# Altium schematic sheet PCB_DecoderB.SchDoc
size A4; DocumentNumber: 4; SheetNumber: 4; SheetTotal: 8
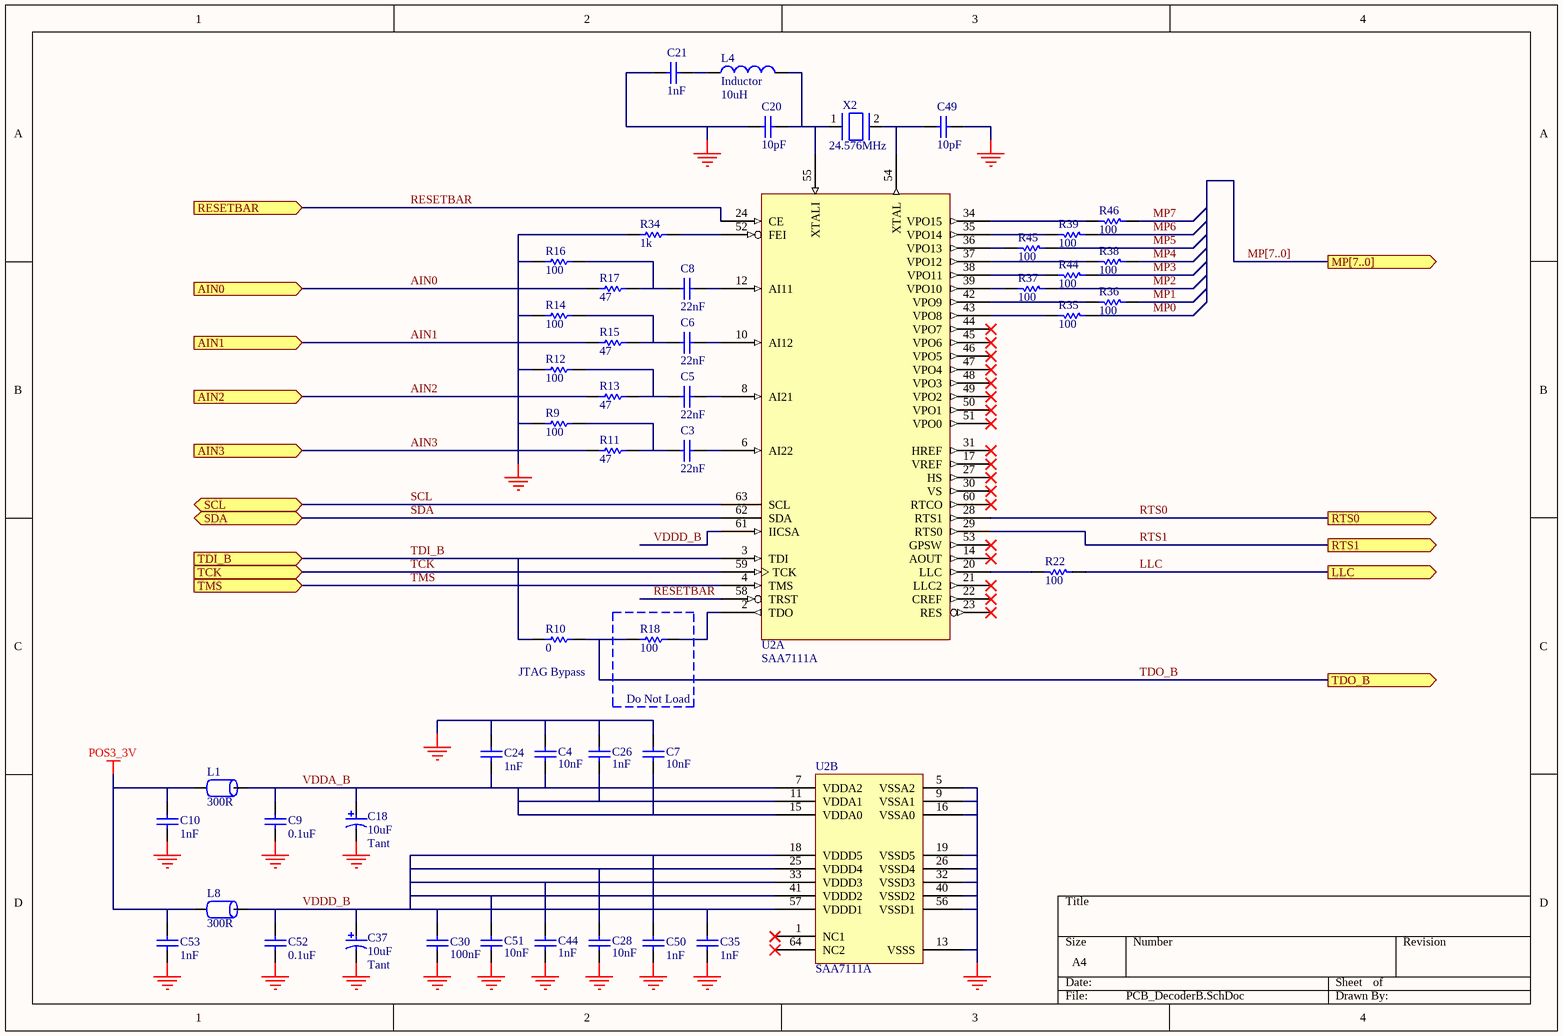
[diagram p0: PCB_DecoderB.SchDoc]

## Parts
C3  22nF  [CC2012-0805]
C4  10nF  [CC2012-0805]
C5  22nF  [CC2012-0805]
C6  22nF  [CC2012-0805]
C7  10nF  [CC2012-0805]
C8  22nF  [CC2012-0805]
C9  0.1uF  [CC2012-0805]
C10  1nF  [CC2012-0805]
C18  10uF  Capacitor Type: Tant  [MCCT-B]
C20  10pF  [CC2012-0805]
C21  1nF  [CC2012-0805]
C24  1nF  [CC2012-0805]
C26  1nF  [CC2012-0805]
C28  10nF  [CC2012-0805]
C30  100nF  [CC2012-0805]
C35  1nF  [CC2012-0805]
C37  10uF  Capacitor Type: Tant  [MCCT-B]
C44  1nF  [CC2012-0805]
C49  10pF  [CC2012-0805]
C50  1nF  [CC2012-0805]
C51  10nF  [CC2012-0805]
C52  0.1uF  [CC2012-0805]
C53  1nF  [CC2012-0805]
L1  300R  [CC2012-0805]
L4  Inductor  value 10uH  [SIMID1008-A]
L8  300R  [CC2012-0805]
R9  100  [CC2012-0805]
R10  0  [CC2012-0805]
R11  47  [CC2012-0805]
R12  100  [CC2012-0805]
R13  47  [CC2012-0805]
R14  100  [CC2012-0805]
R15  47  [CC2012-0805]
R16  100  [CC2012-0805]
R17  47  [CC2012-0805]
R18  100  [CC2012-0805]
R22  100  [CC2012-0805]
R34  1k  [CC2012-0805]
R35  100  [CC2012-0805]
R36  100  [CC2012-0805]
R37  100  [CC2012-0805]
R38  100  [CC2012-0805]
R39  100  [CC2012-0805]
R44  100  [CC2012-0805]
R45  100  [CC2012-0805]
R46  100  [CC2012-0805]
U2  SAA7111A  [QFP14X14_64]  (parts A,B of 2)
X2  24.576MHz  [QC49/SMD]

## Blocks framed on the sheet
Do Not Load: R18

## Ports
AIN0 (in), AIN1 (in), AIN2 (in), AIN3 (in), LLC (out), MP[7..0] (out), RESETBAR (in), RTS0 (out), RTS1 (out), SCL (bidir), SDA (bidir), TCK (in), TDI_B (in), TDO_B (out), TMS (in)

## Nets
GND: C4.1 C7.1 C9.2 C10.2 C18.2 C20.1 C21.1 C24.1 C26.1 C28.2 C30.2 C35.2 C37.2 C44.2 C49.2 C50.2 C51.2 C52.2 C53.2 R9.1 R12.1 R14.1 R16.1 R34.1 U2.5(VSSA2) U2.9(VSSA1) U2.13(VSSS) U2.16(VSSA0) U2.19(VSSD5) U2.26(VSSD4) U2.32(VSSD3) U2.40(VSSD2) U2.56(VSSD1)
POS3_3V: C10.1 C53.1 L1.1 L8.1
AIN0: R17.1 ; port AIN0
AIN1: R15.1 ; port AIN1
AIN2: R13.1 ; port AIN2
AIN3: R11.1 ; port AIN3
LLC: R22.1 ; port LLC
MP0: R35.1
MP1: R36.1
MP2: R37.1
MP3: R44.1
MP4: R38.1
MP5: R45.1
MP6: R39.1
MP7: R46.1
RESETBAR: U2.24(CE) U2.58(TRST) ; port RESETBAR
RTS0: U2.28(RTS1) ; port RTS0
RTS1: U2.29(RTS0) ; port RTS1
SCL: U2.63(SCL) ; port SCL
SDA: U2.62(SDA) ; port SDA
TCK: U2.59(TCK) ; port TCK
TDI_B: R10.1 U2.3(TDI) ; port TDI_B
TDO_B: R10.2 R18.1 ; port TDO_B
TMS: U2.4(TMS) ; port TMS
VDDA_B: C4.2 C7.2 C9.1 C18.1 C24.2 C26.2 L1.2 U2.7(VDDA2) U2.11(VDDA1) U2.15(VDDA0)
VDDD_B: C28.1 C30.1 C35.1 C37.1 C44.1 C50.1 C51.1 C52.1 L8.2 U2.18(VDDD5) U2.25(VDDD4) U2.33(VDDD3) U2.41(VDDD2) U2.57(VDDD1) U2.61(IICSA)
NetC3_1: C3.1 R9.2 R11.2
NetC3_2: C3.2 U2.6(AI22)
NetC5_1: C5.1 R12.2 R13.2
NetC5_2: C5.2 U2.8(AI21)
NetC6_1: C6.1 R14.2 R15.2
NetC6_2: C6.2 U2.10(AI12)
NetC8_1: C8.1 R16.2 R17.2
NetC8_2: C8.2 U2.12(AI11)
NetC20_2: C20.2 L4.2 U2.55(XTALI) X2.1
NetC21_2: C21.2 L4.1
NetC49_1: C49.1 U2.54(XTAL) X2.2
NetR18_2: R18.2 U2.2(TDO)
NetR22_2: R22.2 U2.20(LLC)
NetR34_2: R34.2 U2.52(FEI)
NetR35_2: R35.2 U2.43(VPO8)
NetR36_2: R36.2 U2.42(VPO9)
NetR37_2: R37.2 U2.39(VPO10)
NetR38_2: R38.2 U2.37(VPO12)
NetR39_2: R39.2 U2.35(VPO14)
NetR44_2: R44.2 U2.38(VPO11)
NetR45_2: R45.2 U2.36(VPO13)
NetR46_2: R46.2 U2.34(VPO15)

Not connected (* = marked no-connect by the designer): U2 1(NC1)* 14(AOUT)* 17(VREF)* 21(LLC2)* 22(CREF)* 23(RES)* 27(HS)* 30(VS)* 31(HREF)* 44(VPO7)* 45(VPO6)* 46(VPO5)* 47(VPO4)* 48(VPO3)* 49(VPO2)* 50(VPO1)* 51(VPO0)* 53(GPSW)* 60(RTCO)* 64(NC2)*

## Buses and harness runs
bus MP[7..0] = port MP[7..0]

## Notes on the sheet
- (near R10) JTAG Bypass

## Library data of the parts
C3-C10 C20 C21 C24 C26 C28 C30 C35 C44 C49-C53 = CAP: Capacitor; Fitted: True
C18 C37 = CAP_POLAR: Polar Capacitor; Fitted: True
L1 L8 = FERRITE_BEAD: BMB Series Ferrite Chip Bead
L4 = Inductor: Manufacturer: Generic Components; Class I: Passive; Published: 8-Jun-2000; Revision: July-2002: Re-released for DXP Platform.; Publisher: Altium Limited; Class II: Inductor
R9-R18 R22 R34-R39 R44-R46 = RES: Resistor; Fitted: True
U2 = SAA7111A: Philips Enhanced Video Input Processor
X2 = CRYSTAL